# EasyEDA Pro project ESP32_Dev_Board.epro, schematic Schematic1
Board Name: Board1; Create Date: 2026-03-27; Page Name: P1; Project Name: ESP32 Dev Board; Schematic Name: Schematic1; Update Date: 2026-04-09; Company: EasyEDA.com; Page Size: A4; Version: V1.0
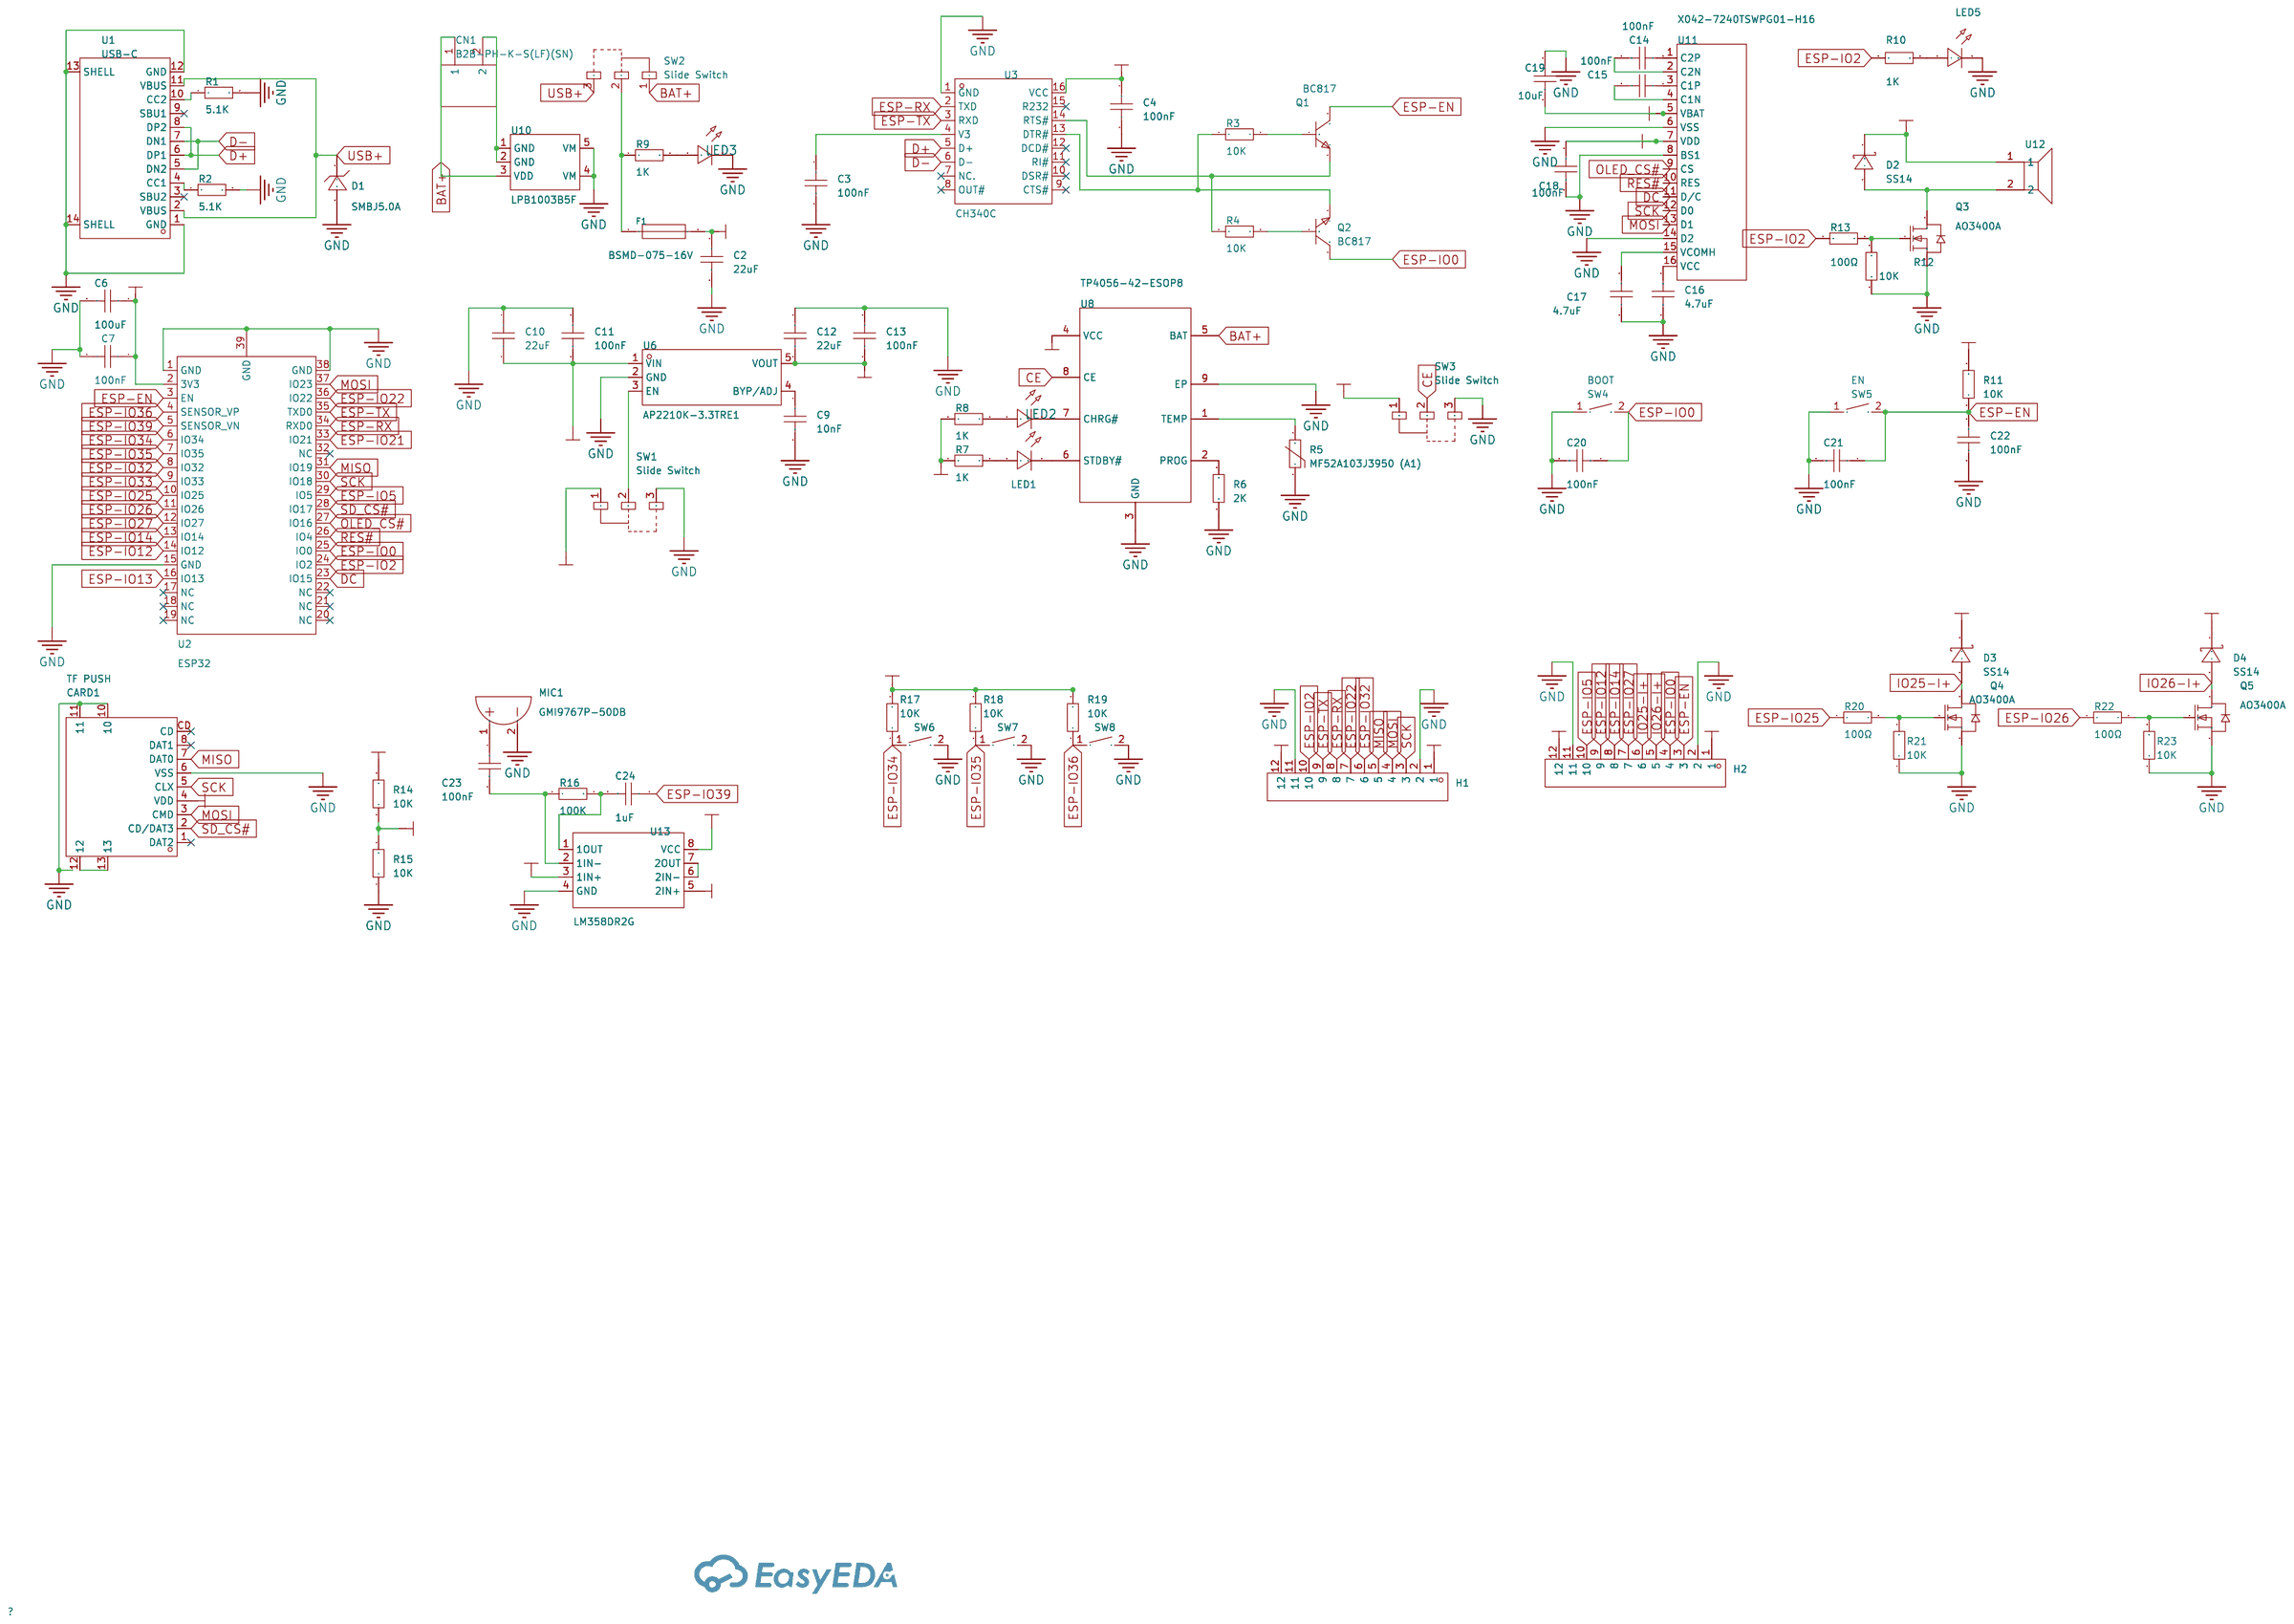
[diagram p0: schematic sheet]

## Parts
C2  22uF  [C0805]
C3  100nF  [C0805]
C4  100nF  [C0805]
C6  100uF  [C0805]
C7  100nF  [C0805]
C9  10nF  [C0805]
C10  22uF  [C0805]
C11  100nF  [C0805]
C12  22uF  [C0805]
C13  100nF  [C0805]
C14  100nF  [C0805]
C15  100nF  [C0805]
C16  4.7uF  [C0805]
C17  4.7uF  [C0805]
C18  100nF  [C0805]
C19  10uF  [C0805]
C20  100nF  [C0805]
C21  100nF  [C0805]
C22  100nF  [C0805]
C23  100nF  [C0805]
C24  1uF  [C0805]
CARD1  TF PUSH  [TF-SMD_TF-PUSH]
CN1  B2B-PH-K-S(LF)(SN)  [CONN-TH_B2B-PH-K-S]
D1  SMBJ5.0A  [DO-214AA_L4.4-W3.6-LS5.3-BI]
D2  SS14  [SMA_L4.4-W2.6-LS5.0-RD]
D3  SS14  [SMA_L4.4-W2.6-LS5.0-RD]
D4  SS14  [SMA_L4.4-W2.6-LS5.0-RD]
F1  BSMD-075-16V  [R0805]
H1  -  [HDR-TH_12P-P2.54-V-M]
H2  -  [HDR-TH_12P-P2.54-V-M]
LED1  -  [LED0805-RD_GREEN]
LED2  -  [LED0805-R-RD]
LED3  -  [LED0805-R-RD]
LED5  -  [LED0805-RD_GREEN]
MIC1  GMI9767P-50DB  [MIC-TH_BD9.7-P2.54-D0.8-L-FD]
Q1  BC817  [SOT-23-3_L2.9-W1.4-P1.91-LS2.6-BR]
Q2  BC817  [SOT-23-3_L2.9-W1.4-P1.91-LS2.6-BR]
Q3  AO3400A  [SOT-23-3_L2.9-W1.3-P1.90-LS2.4-BR]
Q4  AO3400A  [SOT-23-3_L2.9-W1.3-P1.90-LS2.4-BR]
Q5  AO3400A  [SOT-23-3_L2.9-W1.3-P1.90-LS2.4-BR]
R1  5.1K  [R0805]
R2  5.1K  [R0805]
R3  10K  [R0805]
R4  10K  [R0805]
R5  MF52A103J3950 (A1)  [RES-TH_L2.5-W2.5-P1.70-D0.3]
R6  2K  [R0805]
R7  1K  [R0805]
R8  1K  [R0805]
R9  1K  [R0805]
R10  1K  [R0805]
R11  10K  [R0805]
R12  10K  [R0805]
R13  100Ω  [R0805]
R14  10K  [R0805]
R15  10K  [R0805]
R16  100K  [R0805]
R17  10K  [R0805]
R18  10K  [R0805]
R19  10K  [R0805]
R20  100Ω  [R0805]
R21  10K  [R0805]
R22  100Ω  [R0805]
R23  10K  [R0805]
SW1  Slide Switch  [SW-SMD_3P-L9.1-W3.5-P2.50_MST-12D18G2]
SW2  Slide Switch  [SW-SMD_3P-L9.1-W3.5-P2.50_MST-12D18G2]
SW3  Slide Switch  [SW-SMD_3P-L9.1-W3.5-P2.50_MST-12D18G2]
SW4  BOOT  [KEY-SMD_L4.0-W3.0-LS4.9-1]
SW5  EN  [KEY-SMD_L4.0-W3.0-LS4.9-1]
SW6  EN  [KEY-SMD_L4.0-W3.0-LS4.9-1]
SW7  EN  [KEY-SMD_L4.0-W3.0-LS4.9-1]
SW8  EN  [KEY-SMD_L4.0-W3.0-LS4.9-1]
U1  USB-C  [USB-C-SMD_TYPE-C-6PIN-2MD-073]
U2  ESP32  [WIFI-SMD_ESP32-WROOM-32E]
U3  CH340C  [SOP-16_L10.0-W3.9-P1.27-LS6.0-BL]
U6  AP2210K-3.3TRE1  [SOT-23-5_L3.0-W1.7-P0.95-LS2.8-BR]
U8  TP4056-42-ESOP8  [ESOP-8_L4.9-W3.9-P1.27-LS6.0-BL-EP]
U10  LPB1003B5F  [SOT-23-5_L3.0-W1.6-P0.95-LS2.8-BL]
U11  X042-7240TSWPG01-H16  [OLED-SMD_16P-P0.65-X042-7240TSWPG01-H16]
U12  -  [C0805]
U13  LM358DR2G  [SOIC-8_L5.0-W4.0-P1.27-LS6.0-BL]

## Library data of the parts
C2-C4 C6 C7 C9-C24 = CAP_0805: Supplier Footprint: 0805
CARD1 = TF PUSH: Card Connection Mode:Push-Push Card Type:MicroSD Card (TF Card) Connector Type:Connector and Ejector Additional Card Detection Pins:No Supplementary Features:- Height Above Board:2mm Operating Temperature:-25℃~+90℃ Operating Temperature:-25℃~+90℃; LCSC Part Name: 9P，自弹式TF卡座; Supplier Part: C393941; Manufacturer: SHOU HAN(首韩); Supplier Footprint: SMD; JLCPCB Part Class: Extended Part; Datasheet: https://item.szlcsc.com/datasheet/TF%2520PUSH/372553.html; Supplier: LCSC; Card Connection Mode: Push-Push; Card Type: MicroSD Card (TF Card); Connector Type: Connector and Ejector; Additional Card Detection Pins: No; Height Above Board: 2mm; Operating Temperature: -25℃~+90℃
CN1 = B2B-PH-K-S(LF)(SN): Pins Structure:1x2P Pitch:2mm Mounting Type:Through Hole Reference Series:PH Number of Pins:2P Number of Rows:1 Number of PINs Per Row:2 Row Spacing:- Current Rating:2A Contact Material:Brass Contact Plating:Tin Operating Temperature:-25℃~+85℃ Operating T; LCSC Part Name: 1x2P 间距:2mm 直插 系列:PH; Supplier Part: C131337; Manufacturer: JST; Supplier Footprint: 插件,P=2mm; JLCPCB Part Class: Extended Part; Datasheet: https://item.szlcsc.com/datasheet/B2B-PH-K-S(LF)(SN)/142630.html; Supplier: LCSC; Pins Structure: 1x2P; Pitch: 2mm; Mounting Type: Through Hole; Reference Series: PH; Number of Pins: 2P; Number of Rows: 1; Number of PINs Per Row: 2; Current Rating: 2A; Contact Material: Brass; Contact Plating: Tin; Operating Temperature: -25℃~+85℃; Voltage Rating: 100V; Plastic Material: PA66; Flame Retardant Rating: UL94V-0; Supplementary Features: K Pin; Color: White; Z-Height of the Board: 6mm; X-Length of Bottom Edge on Board (Spacing Line): 5.9mm; Y-Width of Bottom Edge on Board: 4.5mm
D1 = SMBJ5.0A_C83333: Polarity:Unidirectional Reverse Stand-Off Voltage (Vrwm):5V Clamping Voltage:9.2V Peak Pulse Current (Ipp):65.3A Peak Pulse Power Dissipation (Ppp):600W Voltage - Breakdown:6.4V Reverse Leakage Current (Ir):65.3uA Operating Temperature:-65℃~+150℃ Operatin; LCSC Part Name: 单向TVS 5V截止 峰值浪涌电流：65.3A; Supplier Part: C83333; Manufacturer: Littelfuse(美国力特); Supplier Footprint: DO-214AA; JLCPCB Part Class: Extended Part; Datasheet: https://item.szlcsc.com/datasheet/SMBJ5.0A/84497.html; Supplier: LCSC; Polarity: Unidirectional; Reverse Stand-Off Voltage (Vrwm): 5V; Clamping Voltage: 9.2V; Peak Pulse Current (Ipp): 65.3A; Peak Pulse Power Dissipation (Ppp): 600W; Voltage - Breakdown: 6.4V; Reverse Leakage Current (Ir): 65.3uA; Operating Temperature: -65℃~+150℃; level of protection: IEC 61000-4-4；IEC 61000-4-2; Type: TVS
D2-D4 = SS14_C48782961: Voltage - Forward(Vf@If):700mV@1A Voltage - DC Reverse(Vr):40V Current - Rectified:1A Operating Junction Temperature Range:-55℃~+150℃ Operating Junction Temperature Range:-55℃~+150℃ Non-Repetitive Peak Forward Surge Current:30A; LCSC Part Name: 40V 1A; Supplier Part: C48782961; Manufacturer: HT(金誉); Supplier Footprint: SMA; JLCPCB Part Class: Extended Part; Datasheet: https://item.szlcsc.com/datasheet/SS14/51079493.html; Supplier: LCSC; Voltage - Forward(Vf@If): 700mV@1A; Voltage - DC Reverse(Vr): 40V; Current - Rectified: 1A; Operating Junction Temperature Range: -55℃~+150℃; Non-Repetitive Peak Forward Surge Current: 30A
F1 = BSMD0805-075-16V: Voltage - Max:16V Current - Max:40A Hold Current:750mA Trip Current:1.5A Power Dissipation:600mW Resistance - Initial (Ri) (Min):70mΩ Resistance - Post Trip (R1) (Max):385mΩ Time to Trip(Max):8s Operating Temperature:-40℃~+85℃ Operating Temperature:-40℃~+; LCSC Part Name: 16V 750mA 0805自恢复; Supplier Part: C976303; Manufacturer: BHFUSE(佰宏); Supplier Footprint: 0805; JLCPCB Part Class: Extended Part; Datasheet: https://item.szlcsc.com/datasheet/BSMD0805-075-16V/1067302.html; Supplier: LCSC; Voltage - Max: 16V; Current - Max: 40A; Hold Current: 750mA; Trip Current: 1.5A; Power Dissipation: 600mW; Resistance - Initial (Ri) (Min): 70mΩ; Resistance - Post Trip (R1) (Max): 385mΩ; Time to Trip(Max): 8s; Operating Temperature: -40℃~+85℃; Length: 2.2mm; Width: 1.5mm; Height: 1.1mm
H1 H2 = HDR-M_2.54_1x12P: Supplier Footprint: Through
LED1 LED5 = LED_0805-G: Supplier Footprint: 0805
LED2 LED3 = LED_0805-R: Supplier Footprint: 0805
MIC1 = GMI9767P-50DB: Voltage - Supply:4.5V Voltage - Supply:4.5V Current - Supply:500uA Direction:Omnidirectional Output Impedance:2.2kΩ S/N Ratio:58dB Sensitivity:-50dB Diameter(φD):9.7mm Height:6.7mm Operating Temperature:-20℃~+60℃ Operating Temperature:-20℃~+60℃ Mounting T; LCSC Part Name: 全指向φ9.7*6.7mm 1.5V-10V 灵敏度-50db 低阻抗 针脚; Supplier Part: C234022; Manufacturer: INGHAi(赢海); Supplier Footprint: 插件,D=9.7mm; JLCPCB Part Class: Extended Part; Datasheet: https://item.szlcsc.com/datasheet/GMI9767P-50DB/233804.html; Supplier: LCSC; Voltage - Supply: 4.5V; Current - Supply: 500uA; Direction: Omnidirectional; Output Impedance: 2.2kΩ; S/N Ratio: 58dB; Sensitivity: -50dB; Diameter(φD): 9.7mm; Height: 6.7mm; Operating Temperature: -20℃~+60℃; Mounting Type: 插件
Q1 Q2 = BC817: type:NPN Current - Collector(Ic):500mA Collector - Emitter Voltage VCEO:45V Pd - Power Dissipation:300mW Transition frequency(fT):100MHz Current - Collector Cutoff:100nA Vce Saturation(VCE(sat)):700mV Operating Temperature:- Operating Temperature:-; LCSC Part Name: NPN 电流:500mA 电压:45V; Supplier Part: C466643; Manufacturer: High Diode(海德); Supplier Footprint: SOT-23; JLCPCB Part Class: Extended Part; Datasheet: https://item.szlcsc.com/datasheet/BC817/471771.html; Supplier: LCSC; type: NPN; Current - Collector(Ic): 500mA; Collector - Emitter Voltage VCEO: 45V; Pd - Power Dissipation: 300mW; Transition frequency(fT): 100MHz; Current - Collector Cutoff: 100nA; Vce Saturation(VCE(sat)): 700mV
Q3-Q5 = AO3400A_C5380685: Number:One N-channel Drain to Source Voltage:30V Current - Continuous Drain(Id):5.8A RDS(on):52mΩ@2.5V,4A Pd - Power Dissipation:1.2W Gate Threshold Voltage (Vgs(th)):700mV Gate Charge(Qg):17.5nC Input Capacitance(Ciss):630pF@15V Reverse Transfer Capacita; LCSC Part Name: 1个N沟道 耐压:30V 电流:5.8A; Supplier Part: C5380685; Manufacturer: FUXINSEMI(富芯森美); Supplier Footprint: SOT-23; JLCPCB Part Class: Extended Part; Datasheet: https://item.szlcsc.com/datasheet/AO3400A/6248449.html; Supplier: LCSC; Number: One N-channel; Drain to Source Voltage: 30V; Current - Continuous Drain(Id): 5.8A; RDS(on): 52mΩ@2.5V,4A; Pd - Power Dissipation: 1.2W; Gate Threshold Voltage (Vgs(th)): 700mV; Gate Charge(Qg): 17.5nC; Input Capacitance(Ciss): 630pF@15V; Reverse Transfer Capacitance (Crss@Vds): 70pF@15V; Operating Temperature: -55℃~+150℃
R1-R4 R6-R23 = Res_0805: Supplier Footprint: 0805
R5 = MF52A103J3950 (A1): Resistance @ 25℃:10kΩ B Constant (25℃/50℃):3950K Resistance Tolerance:±5% Resistance Tolerance:±5% B Constant (25℃/75℃):- B Constant (25℃/85℃):4021K B Constant (25℃/100℃):- Power(Watts):50mW B Constant Tolerance:±1% Steady State Current (Max):- Operating; LCSC Part Name: 10kΩ 3950K 50mW 珠状测温型NTC热敏电阻器; Supplier Part: C123378; Manufacturer: 时恒; Supplier Footprint: 插件,P=1.7mm; JLCPCB Part Class: Extended Part; Datasheet: https://item.szlcsc.com/datasheet/MF52A103J3950%2520(A1)/124648.html; Supplier: LCSC; Resistance @ 25℃: 10kΩ; B Constant (25℃/50℃): 3950K; Resistance Tolerance: ±5%; B Constant (25℃/85℃): 4021K; Power(Watts): 50mW; B Constant Tolerance: ±1%; Operating Temperature: -55℃~+125℃; Dissipation Factor: 2mW/℃; Thermal Time Constant: 7s; Pitch: 1.7mm
SW1-SW3 = MST-12D18G2 SMD Slide Switch: Circuit:SPDT Actuator Style:Rectangular Columnar Termination Style:SMD(SMT) Tab Length:9.1mm Width:3.5mm Switch Height:5.5mm Mounting Type:Surface Mount, Right Angle Actuator Color:Black Current Rating:100mA Voltage Rating:12V Life:10,000 Cycles Operating; LCSC Part Name: MST-12D18G2卧式带柱编带; Supplier Part: C49023765; Manufacturer: SHOU HAN(首韩); Supplier Footprint: SMD; JLCPCB Part Class: Extended Part; Datasheet: https://item.szlcsc.com/datasheet/MST-12D18G2%2520SMD%2520Slide%2520Switch/51384140.html; Supplier: LCSC; Circuit: SPDT; Actuator Style: Rectangular Columnar; Termination Style: SMD(SMT) Tab; Length: 9.1mm; Width: 3.5mm; Switch Height: 5.5mm; Mounting Type: Surface Mount, Right Angle; Actuator Color: Black; Current Rating: 100mA; Voltage Rating: 12V; Life: 10,000 Cycles; Operating Temperature: -25℃~+70℃
SW4-SW8 = HX 3x4x2-2P-1.6N TACTILE SWITCH: Circuit:SPST Actuator Style:Round Button Operating Force:1.6N Mounting Type:Surface Mount,Vertical Length:4mm Width:3mm Switch Height:2mm with Bracket:Without Bracket Contact Current:50mA Voltage Rating:12V Actuator/Cap Color:Black With Lamp:No IP Rating:; LCSC Part Name: 4*3*2mm 立贴 轻触开关; Supplier Part: C49234124; Manufacturer: hanxia(韩下); Supplier Footprint: SMD; JLCPCB Part Class: Extended Part; Datasheet: https://item.szlcsc.com/datasheet/HX%25203x4x2-2P-1.6N%2520TACTILE%2520SWITCH/51650185.html; Supplier: LCSC; Circuit: SPST; Actuator Style: Round Button; Operating Force: 1.6N; Mounting Type: Surface Mount,Vertical; Length: 4mm; Width: 3mm; Switch Height: 2mm; with Bracket: Without Bracket; Contact Current: 50mA; Voltage Rating: 12V; Actuator/Cap Color: Black; With Lamp: No; Termination Style: SMD(SMT) Tab; Life: 100,000 Cycles
U1 = TYPE-C 16PIN 2MD(073): Connector Type:Type-C Protocol Standard:- Gender:Female Mounting Type:Surface Mount, Right Angle Number of Contacts:16P Number of Ports:1 Current Rating-Power:3A Voltage Rating:5V Connect-Disconnect Life:10,000 Cycles Supplementary Features:- Center Heigh; LCSC Part Name: Type-C 母 卧贴; Supplier Part: C2765186; Manufacturer: SHOU HAN(首韩); Supplier Footprint: SMD; JLCPCB Part Class: Extended Part; Datasheet: https://item.szlcsc.com/datasheet/TYPE-C%252016PIN%25202MD(073)/2901843.html; Supplier: LCSC; Connector Type: Type-C; Gender: Female; Mounting Type: Surface Mount, Right Angle; Number of Contacts: 16P; Number of Ports: 1; Current Rating-Power: 3A; Voltage Rating: 5V; Connect-Disconnect Life: 10,000 Cycles; Detection color: Black; Operating Temperature: -25℃~+85℃
U2 = ESP32-WROOM-32E-N4: Utilized IC / Part:ESP32-D0WDR2-V3；ESP32-D0WD-V3 Wireless Standard:Bluetooth4.2 Interface Type:I2C；GPIO；UART；SPI；SDIO Frequency:2.4GHz Antenna Type:On-board PCB Antenna Output Power:20dBm Output Power:20dBm Voltage - Supply:3V~3.6V Voltage - Supply:3V~3.6; LCSC Part Name: 不带固件 通用型Wi-Fi+BT+BLE MCU模组; Supplier Part: C701341; Manufacturer: ESPRESSIF(乐鑫); Supplier Footprint: SMD,25.5x18mm; JLCPCB Part Class: Extended Part; Datasheet: https://item.szlcsc.com/datasheet/ESP32-WROOM-32E-N4/736349.html; Supplier: LCSC; Utilized IC / Part: ESP32-D0WDR2-V3；ESP32-D0WD-V3; Wireless Standard: Bluetooth4.2; Interface Type: I2C；GPIO；UART；SPI；SDIO; Antenna Type: On-board PCB Antenna; Output Power: 20dBm; Voltage - Supply: 3V~3.6V; Receive  Current: 112mA; Send  Current: 239mA; Sensitivity: -98dBm; Operating Temperature: -40℃~+85℃
U3 = CH340C: Applications Function:Transceiver USB Protocol:USB 2.0 Voltage - Supply:3.3V；5V Voltage - Supply:3.3V；5V Data Rate:2Mbps Operating Temperature:-20℃~+70℃ Operating Temperature:-20℃~+70℃ Current - Supply:7mA Supply Current (Iq):50uA; LCSC Part Name: USB转串口芯片; Supplier Part: C84681; Manufacturer: WCH(南京沁恒); Supplier Footprint: SOP-16; JLCPCB Part Class: Extended Part; Datasheet: https://item.szlcsc.com/datasheet/CH340C/85852.html; Supplier: LCSC; Applications Function: Transceiver; USB Protocol: USB 2.0; Voltage - Supply: 3.3V；5V; Data Rate: 2Mbps; Operating Temperature: -20℃~+70℃; Current - Supply: 7mA; Supply Current (Iq): 50uA
U6 = AP2210K-3.3TRE1: Output Type:Fixed Voltage - Supply:13.2V Output Voltage:3.3V Output Voltage:3.3V Output Current:300mA Power Supply Rejection Ratio (PSRR):75dB@(100Hz) Voltage Dropout:250mV@(300mA) standby current:1uA Features:Reverse connection protection；Over Temperatur; LCSC Part Name: 停产 输入13.2V 输出3.3V 300mA 停产; Supplier Part: C264085; Manufacturer: DIODES(美台); Supplier Footprint: SOT-23-5; JLCPCB Part Class: Extended Part; Datasheet: https://item.szlcsc.com/datasheet/AP2210K-3.3TRE1/255294.html; Supplier: LCSC; Output Type: Fixed; Voltage - Supply: 13.2V; Output Voltage: 3.3V; Output Current: 300mA; Power Supply Rejection Ratio (PSRR): 75dB@(100Hz); Voltage Dropout: 250mV@(300mA); standby current: 1uA; Features: Reverse connection protection；Over Temperature Protection；Over Current Protection；Enable; Operating Temperature: -40℃~+125℃@(Tj); Output Configuration: Positive; Number of Outputs: 1
U8 = TP4056-42-ESOP8: The Chip Type:Charging IC Voltage - Supply:4V~8V Voltage - Supply:4V~8V Charge Current - Max:1A Charging Saturation Voltage:4.2V End-Off Voltage:- Type of Battery:Lithium Battery Number of Cells:1 Number of Cells:1 Operating Temperature:-40℃~+85℃ Operatin; LCSC Part Name: 1A线性锂离子电池充电器; Supplier Part: C16581; Manufacturer: TOPPOWER(南京拓微); Supplier Footprint: ESOP-8; JLCPCB Part Class: Extended Part; Datasheet: https://item.szlcsc.com/datasheet/TP4056-42-ESOP8/17264.html; Supplier: LCSC; The Chip Type: Charging IC; Voltage - Supply: 4V~8V; Charge Current - Max: 1A; Charging Saturation Voltage: 4.2V; Type of Battery: Lithium Battery; Number of Cells: 1; Operating Temperature: -40℃~+85℃; Battery Temperature Detection: Support; Supply Current (Iq): 2uA
U10 = LPB1003B5F: The Chip Type:Protection IC Voltage - Supply:2.4V~10V Voltage - Supply:2.4V~10V Charge Current - Max:- Charging Saturation Voltage:4.3V End-Off Voltage:2.4V Type of Battery:Lithium Battery Number of Cells:1 Number of Cells:1 Operating Temperature:-40℃~+85; LCSC Part Name: 单节锂电池保护IC; Supplier Part: C2902427; Manufacturer: LOWPOWER(微源半导体); Supplier Footprint: SOT-23-5; JLCPCB Part Class: Extended Part; Datasheet: https://item.szlcsc.com/datasheet/LPB1003B5F/3154863.html; Supplier: LCSC; The Chip Type: Protection IC; Voltage - Supply: 2.4V~10V; Charging Saturation Voltage: 4.3V; End-Off Voltage: 2.4V; Type of Battery: Lithium Battery; Number of Cells: 1; Operating Temperature: -40℃~+85℃; Battery Temperature Detection: Not supported; 0V Battery Charge: Support; Supply Current (Iq): 2.2uA
U11 = X042-7240TSWPG01-H16_C18723008: Supplier Part: C18723008; Manufacturer: Wisevision(新智景); JLCPCB Part Class: Extended Part; Datasheet: https://item.szlcsc.com/datasheet/X042-7240TSWPG01-H16/19915582.html; Supplier: LCSC
U12 = Speaker: C18221550
U13 = LM358DR2G: Number of Channels:2 Maximum Power Supply Range (Vdd-Vss):32V Rail to Rail:- Gain Bandwidth Product:- Vos - Input Offset Voltage:7mV Input Offset Voltage Drift(Vos TC):10uV/℃ Slew Rate:- Ib - Input Bias Current:150nA Input Offset Current(Ios):5nA Input Vo; LCSC Part Name: 单电源双运算放大器; Supplier Part: C7950; Manufacturer: onsemi(安森美); Supplier Footprint: SOIC-8; JLCPCB Part Class: Basic Part; Datasheet: https://item.szlcsc.com/datasheet/LM358DR2G/8427.html; Supplier: LCSC; Number of Channels: 2; Maximum Power Supply Range (Vdd-Vss): 32V; Vos - Input Offset Voltage: 7mV; Input Offset Voltage Drift(Vos TC): 10uV/℃; Ib - Input Bias Current: 150nA; Input Offset Current(Ios): 5nA; Common Mode Rejection Ratio(CMRR): 70dB; Input offset current drift(Ios TC): 10pA/℃; Quiescent Current: 700uA; Output Current: 40mA; Operating Temperature: 0℃~+70℃; Single supply: 3V~32V; Dual Supply: -16V~16V

## Nets
+1.65V: R14.1 R15.2 U13.3(1IN+) U13.5(2IN+)
+3V3: C6.1 C7.1 C12.2 C13.2 C18.1 C19.2 CARD1.4(VDD) H1.1 H2.12 R11.2 R14.2 R17.2 R18.2 R19.2 U2.2(3V3) U6.5(VOUT) U11.5(VBAT) U11.7(VDD) U13.8(VCC)
GND: C2.2 C3.2 C4.2 C6.2 C7.2 C9.2 C10.1 C11.1 C12.1 C13.1 C16.2 C17.2 C18.2 C19.1 C20.2 C21.2 C22.2 CARD1.6(VSS) CARD1.10 CARD1.11 D1.2 H1.2 H1.11 H2.2 H2.11 LED3.2(C) LED5.1(C) MIC1.2 Q3.2(S) Q4.2(S) Q5.2(S) R1.2 R2.2 R5.1 R6.1 R12.1 R15.1 R21.1 R23.1 SW1.3 SW3.3 SW4.1 SW5.1 SW6.2 SW7.2 SW8.2 U1.1(GND) U1.12(GND) U1.13(SHELL) U1.14(SHELL) U2.1(GND) U2.15(GND) U2.38(GND) U2.39(GND) U3.1(GND) U6.2(GND) U8.3(GND) U8.9(EP) U10.4(VM) U10.5(VM) U11.6(VSS) U11.8(BS1) U11.14(D2) U13.4(GND)
VIN: C2.1 C10.2 C11.2 D2.1(C) D3.1(C) D4.1(C) F1.2 H1.12 H2.1 R7.1 R8.1 SW1.1 SW3.1 U6.1(VIN) U8.4(VCC) U12.1
BAT+: CN1.1 SW2.1 U8.5(BAT) U10.3(VDD)
CE: SW3.2 U8.8(CE)
D+: U1.6(DP1) U1.8(DP2) U3.5(D+)
D-: U1.5(DN2) U1.7(DN1) U3.6(D-)
DC: U2.23(IO15) U11.11(D/C)
ESP-EN: C21.1 C22.1 H2.3 Q1.3(C) R11.1 SW5.2 U2.3(EN)
ESP-IO0: C20.1 H2.4 Q2.3(C) SW4.2 U2.25(IO0)
ESP-IO2: H1.10 R10.1 R13.1 U2.24(IO2)
ESP-IO5: H2.10 U2.29(IO5)
ESP-IO12: H2.9 U2.14(IO12)
ESP-IO13: U2.16(IO13)
ESP-IO14: H2.8 U2.13(IO14)
ESP-IO21: U2.33(IO21)
ESP-IO22: H1.7 U2.36(IO22)
ESP-IO25: R20.1 U2.10(IO25)
ESP-IO26: R22.1 U2.11(IO26)
ESP-IO27: H2.7 U2.12(IO27)
ESP-IO32: H1.6 U2.8(IO32)
ESP-IO33: U2.9(IO33)
ESP-IO34: R17.1 SW6.1 U2.6(IO34)
ESP-IO35: R18.1 SW7.1 U2.7(IO35)
ESP-IO36: R19.1 SW8.1 U2.4(SENSOR_VP)
ESP-IO39: C24.1 U2.5(SENSOR_VN)
ESP-RX: H1.8 U2.34(RXD0) U3.2(TXD)
ESP-TX: H1.9 U2.35(TXD0) U3.3(RXD)
IO25-I+: D3.2(A) H2.6 Q4.3(D)
IO26-I+: D4.2(A) H2.5 Q5.3(D)
MISO: CARD1.7(DAT0) H1.5 U2.31(IO19)
MOSI: CARD1.3(CMD) H1.4 U2.37(IO23) U11.13(D1)
OLED_CS#: U2.27(IO16) U11.9(CS)
RES#: U2.26(IO4) U11.10(RES)
SCK: CARD1.5(CLX) H1.3 U2.30(IO18) U11.12(D0)
SD_CS#: CARD1.2(CD/DAT3) U2.28(IO17)
USB+: C4.1 D1.1 SW2.3 U1.2(VBUS) U1.11(VBUS) U3.16(VCC)
$1N1664: R1.1 U1.10(CC2)
$1N1690: R2.1 U1.4(CC1)
$1N3674: Q1.2(E) R4.1 U3.14(RTS#)
$1N3702: Q2.2(E) R3.1 U3.13(DTR#)
$1N3778: Q1.1(B) R3.2
$1N3782: Q2.1(B) R4.2
$1N3890: C3.1 U3.4(V3)
$1N5276: C9.1 U6.4(BYP/ADJ)
$1N5341: SW1.2 U6.3(EN)
$1N6158: F1.1 R9.1 SW2.2
$1N7611: R5.2 U8.1(TEMP)
$1N7665: R6.2 U8.2(PROG)
$1N7714: LED1.1(C) U8.6(STDBY#)
$1N7763: LED1.2(A) R7.2
$1N7878: LED2.2(C) U8.7(CHRG#)
$1N7880: LED2.1(A) R8.2
$1N8003: LED3.1(A) R9.2
$1N10148: CN1.2 U10.1(GND) U10.2(GND)
$1N11462: C14.1 U11.1(C2P)
$1N11466: C14.2 U11.2(C2N)
$1N11493: C15.1 U11.3(C1P)
$1N11497: C15.2 U11.4(C1N)
$1N13259: C16.1 U11.16(VCC)
$1N14442: C17.1 U11.15(VCOMH)
$1N14768: LED5.2(A) R10.2
$1N16929: Q3.1(G) R12.2 R13.2
$1N16963: D2.2(A) Q3.3(D) U12.2
$1N17452: CARD1.12 CARD1.13
$1N20706: U13.6(2IN-) U13.7(2OUT)
$1N21042: C23.1 MIC1.1
$1N21070: C23.2 R16.1 U13.2(1IN-)
$1N21124: C24.2 R16.2 U13.1(1OUT)
$1N31105: Q4.1(G) R20.2 R21.2
$1N31458: Q5.1(G) R22.2 R23.2

Not connected (* = marked no-connect by the designer): CARD1 1(DAT2)* 8(DAT1)* CD*; U1 3(SBU2)* 9(SBU1)*; U2 17(NC)* 18(NC)* 19(NC)* 20(NC)* 21(NC)* 22(NC)* 32(NC)*; U3 7(NC.)* 8(OUT#)* 9(CTS#)* 10(DSR#)* 11(RI#)* 12(DCD#)* 15(R232)*
